# Altium schematic sheet SuperClock_Core_WIFI.SchDoc
size A4; Organization: Altium Limited; Address1: L3, 12a Rodborough Rd; Address2: Frenchs Forest; Address3: NSW; Address4: Australia 2086
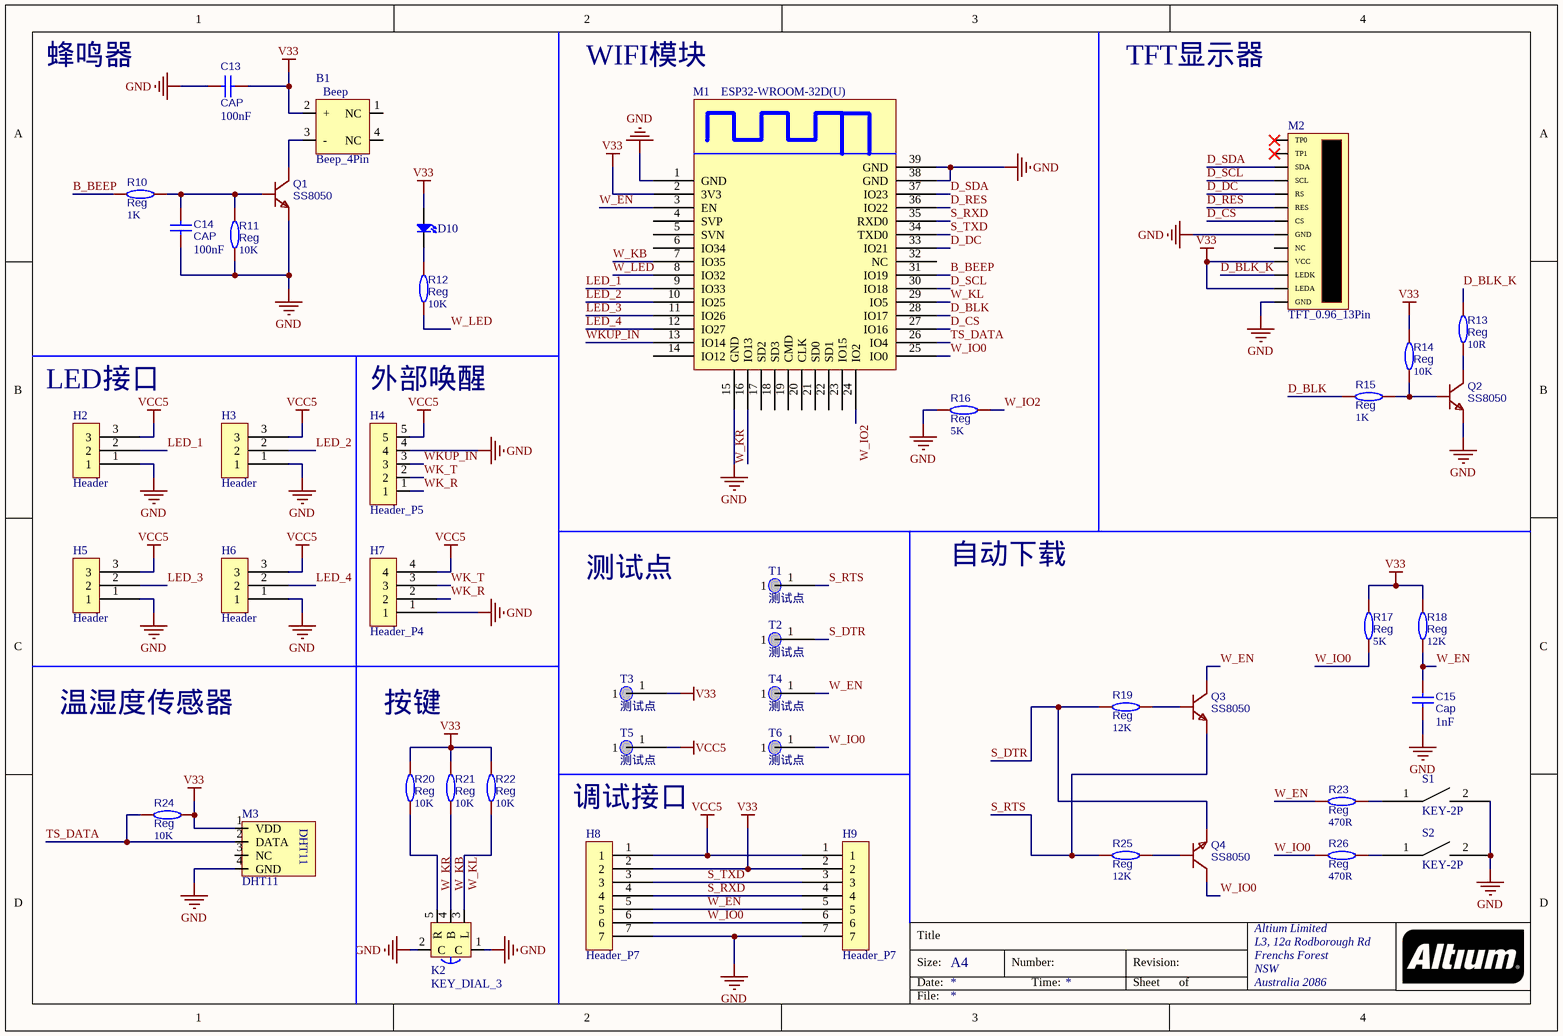
[diagram p0: SuperClock_Core_WIFI.SchDoc]

## Parts
B1  Beep_4Pin  [Beep_4Pin_7525]
C13  CAP  value 100nF  [C0603]
C14  CAP  value 100nF  [C0603]
C15  Cap  value 1nF  [C0603]
D10  LED  [LED0603]  (value not drawn)
H2  Header  [H_2.54_P3]
H3  Header  [H_2.54_P3]
H4  Header_P5  [H_1.27_P5]
H5  Header  [H_2.54_P3]
H6  Header  [H_2.54_P3]
H7  Header_P4  [H_2.54_P4]
H8  Header_P7  [H_2.54_P7]
H9  Header_P7  [H_2.54_P7]
K2  KEY_DIAL_3  [KEY_DIAL_3]
M1  ESP32-WROOM-32D(U)  [ESP32-WROOM-32D]
M2  TFT_0.96_13Pin  [TFT_0.96_13Pin]
M3  DHT11  [SENSOR-TH_DHT11-HOR]
Q1  SS8050  [SOT-23-3]
Q2  SS8050  [SOT-23-3]
Q3  SS8050  [SOT-23-3]
Q4  SS8050  [SOT-23-3]
R10  Reg  value 1K  [R0603]
R11  Reg  value 10K  [R0603]
R12  Reg  value 10K  [R0603]
R13  Reg  value 10R  [R0603]
R14  Reg  value 10K  [R0603]
R15  Reg  value 1K  [R0603]
R16  Reg  value 5K  [R0603]
R17  Reg  value 5K  [R0603]
R18  Reg  value 12K  [R0603]
R19  Reg  value 12K  [R0603]
R20  Reg  value 10K  [R0603]
R21  Reg  value 10K  [R0603]
R22  Reg  value 10K  [R0603]
R23  Reg  value 470R  [R0603]
R24  Reg  value 10K  [R0603]
R25  Reg  value 12K  [R0603]
R26  Reg  value 470R  [R0603]
S1  KEY-2P  [KEY_SOT_P2]
S2  KEY-2P  [KEY_SOT_P2]
T1  测试点  [TEST_POINT]
T2  测试点  [TEST_POINT]
T3  测试点  [TEST_POINT]
T4  测试点  [TEST_POINT]
T5  测试点  [TEST_POINT]
T6  测试点  [TEST_POINT]

## Nets
GND: C13.1 C14.2 C15.2 H2.1 H3.1 H4.4 H5.1 H6.1 H7.1 H8.7 H9.7 K2.1(C) K2.2(C) M1.1(GND) M1.15(GND) M1.38(GND) M1.39(GND) M2.8(GND) M2.13(GND) M3.4(GND) Q1.2(E) Q2.2(E) R11.2 R16.2 S1.2 S2.2
V33: B1.2(+) C13.2 D10.2(A) H8.2 H9.2 M1.2(3V3) M2.10(VCC) M2.12(LEDA) M3.1(VDD) R14.2 R17.2 R18.2 R20.1 R21.1 R22.1 R24.1 T3.1
VCC5: H2.3 H3.3 H4.5 H5.3 H6.3 H7.4 H8.1 H9.1 T5.1
B_BEEP: M1.31(IO19) R10.2
D_BLK: M1.28(IO17) R15.2
D_BLK_K: M2.11(LEDK) R13.2
D_CS: M1.27(IO16) M2.7(CS)
D_DC: M1.33(IO21) M2.5(RS)
D_RES: M1.36(IO22) M2.6(RES)
D_SCL: M1.30(IO18) M2.4(SCL)
D_SDA: M1.37(IO23) M2.3(SDA)
LED_1: H2.2 M1.9(IO33)
LED_2: H3.2 M1.10(IO25)
LED_3: H5.2 M1.11(IO26)
LED_4: H6.2 M1.12(IO27)
S_DTR: Q4.2(E) R19.2 T2.1
S_RTS: Q3.2(E) R25.2 T1.1
S_RXD: H8.4 H9.4 M1.35(RXD0)
S_TXD: H8.3 H9.3 M1.34(TXD0)
TS_DATA: M1.26(IO4) M3.2(DATA) R24.2
W_EN: C15.1 H8.5 H9.5 M1.3(EN) Q3.3(C) R18.1 R23.2 T4.1
W_IO0: H8.6 H9.6 M1.25(IO0) Q4.3(C) R17.1 R26.2 T6.1
W_IO2: M1.24(IO2) R16.1
W_KB: K2.4(B) M1.7(IO35) R21.2
W_KL: K2.3(L) M1.29(IO5) R22.2
W_KR: K2.5(R) M1.16(IO13) R20.2
W_LED: M1.8(IO32) R12.1
WK_R: H4.1 H7.2
WK_T: H4.2 H7.3
WKUP_IN: H4.3 M1.13(IO14)
NetB1_3: B1.3(-) Q1.3(C)
NetC14_1: C14.1 Q1.1(B) R10.1 R11.1
NetD10_1: D10.1(K) R12.2
NetQ2_1: Q2.1(B) R14.1 R15.1
NetQ2_3: Q2.3(C) R13.1
NetQ3_1: Q3.1(B) R19.1
NetQ4_1: Q4.1(B) R25.1
NetR23_1: R23.1 S1.1
NetR26_1: R26.1 S2.1

Not connected (* = marked no-connect by the designer): B1 1(NC) 4(NC); M1 4(SVP) 5(SVN) 6(IO34) 14(IO12) 17(SD2) 18(SD3) 19(CMD) 20(CLK) 21(SD0) 22(SD1) 23(IO15) 32(NC); M2 1(TP0)* 2(TP1)* 9(NC); M3 3(NC)

## Notes on the sheet
- 蜂鸣器
- WIFI模块
- TFT显示器
- (near H2) LED接口
- 外部唤醒
- 测试点
- 自动下载
- 温湿度传感器
- 按键
- 调试接口
- Title
- Size:
- Date:
- A4
- Number:
- Time:
- Revision:
- Sheet
- of
- File:
- (in symbol Beep_4Pin) Beep

## Library data of the parts
B1 = Beep_4Pin: 4Pin蜂鸣器
C13-C15 = CAP: BOM_Manufacturer: Huaxin S&T; BOM_Manufacturer Part: 0603B103K101CT; nameAlias: Capacitance; Contributor: LCSC; BOM_Supplier: LCSC; BOM_Supplier Part: C302008; spicePre: C; spiceSymbolName: 0603B103K101CT
D10 = LED0: Published: 8-Jun-2000; LatestRevisionDate: 08-Jul-2005; LatestRevisionNote: Mech Layer 1 removed.; PackageReference: LED-0; Publisher: Altium Limited; PackageDescription: LED; 2 Leads
H2 H3 H5 H6 = Header_P3: 3Pin接口
H4 = Header_P5: 5Pin排针
H7 = Header_P4: 4Pin排针
H8 H9 = Header_P7: 7Pin排针
K2 = KEY_DIAL_3: 3向拨轮开关
M2 = TFT_0.96_13Pin: ST7735_TFT
M3 = DHT11: 温湿度传感器
Q1-Q4 = SS8050: NPN; BOM_Manufacturer: AnBon; Contributor: LCSC; BOM_Paste Type: recommend; BOM_Supplier: LCSC; BOM_Supplier Part: C541705; BOM_Manufacturer Part: SS8050; spicePre: Q; spiceSymbolName: SS8050_C541705
R10-R26 = Res: 电阻; BOM_Manufacturer: Viking Tech; BOM_Manufacturer Part: AR03BTCX1002A; nameAlias: Resistance (Ohms); Contributor: LCSC; BOM_Supplier: LCSC; BOM_Supplier Part: C465721; spicePre: R; spiceSymbolName: AR03BTCX1002A
S1 S2 = KEY_2P: KEY-2Pp
T1-T6 = TEST_POINT